# Altium schematic sheet Sheet1.SchDoc
size A; SheetNumber: 1; SheetTotal: 1
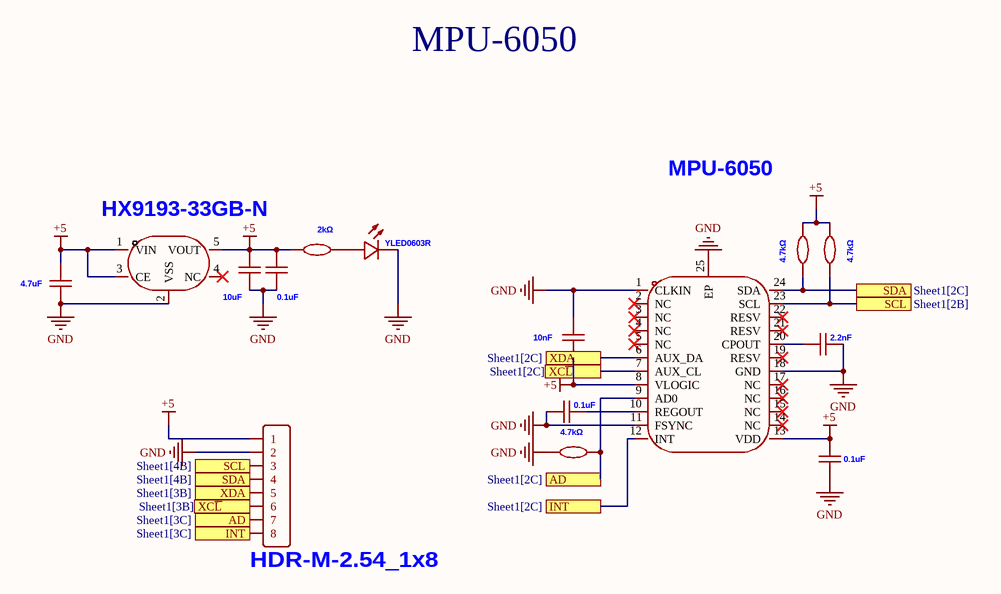
[diagram p0: Sheet1.SchDoc]

## Parts
(Parts that share a designator on the sheet are numbered #1, #2 ... from top to bottom, then left to right.)
BOOSTED_IN  HDR-M-2.54_1x8  [HDR-M-2.54_1X8]
C?#1  10uF  [C0402]
C?#2  0.1uF  [C0402]
C?#3  4.7uF  [C0402]
C?#4  10nF  [C0402]
C?#5  2.2nF  [C0402]
C?#6  0.1uF  [C0402]
C?#7  0.1uF  [C0402]
LED?  YLED0603R  [LED0603-FD]
R?#1  2kΩ  [R0603]
R?#2  4.7kΩ  [R0805]
R?#3  4.7kΩ  [R0805]
R?#4  4.7kΩ  [R0805]
U?#1  HX9193-33GB-N  [SOT-23-5_L2.9-W1.6-P0.95-LS2.8-BL]
U?#2  MPU-6050  [QFN-24_L4.0-W4.0-P0.50-BL-EP2.7]

## Ports
AD (see Sheet1[2C]), AD (see Sheet1[3C]), INT (see Sheet1[2C]), INT (see Sheet1[3C]), SCL (see Sheet1[2B]), SCL (see Sheet1[4B]), SDA (see Sheet1[2C]), SDA (see Sheet1[4B]), XC~{L} (see Sheet1[2C]), XC~{L} (see Sheet1[3B]), XDA (see Sheet1[2C]), XDA (see Sheet1[3B])

## Nets
+5: BOOSTED_IN.1 C?#1.2 C?#2.2 C?#3.2 C?#4.1 C?#7.2 R?#1.1 R?#2.2 R?#3.2 U?#1.1(VIN) U?#1.3(CE) U?#1.5(VOUT) U?#2.8(VLOGIC) U?#2.13(VDD)
GND: BOOSTED_IN.2 C?#1.1 C?#2.1 C?#3.1 C?#4.2 C?#5.2 C?#6.1 C?#7.1 LED?.2(-) R?#4.1 U?#1.2(VSS) U?#2.1(CLKIN) U?#2.11(FSYNC) U?#2.18(GND) U?#2.25(EP)
AD: BOOSTED_IN.7 R?#4.2 U?#2.9(AD0) ; port AD
INT: BOOSTED_IN.8 U?#2.12(INT) ; port INT
SCL: BOOSTED_IN.3 R?#3.1 U?#2.23(SCL) ; port SCL
SDA: BOOSTED_IN.4 R?#2.1 U?#2.24(SDA) ; port SDA
XC~{L}: BOOSTED_IN.6 U?#2.7(AUX_CL) ; port XC~{L}
XDA: BOOSTED_IN.5 U?#2.6(AUX_DA) ; port XDA
NetC?#5_1: C?#5.1 U?#2.20(CPOUT)
NetC?#6_2: C?#6.2 U?#2.10(REGOUT)
NetLED?_1: LED?.1(+) R?#1.2

Not connected (* = marked no-connect by the designer): U?#1 4(NC)*; U?#2 2(NC)* 3(NC)* 4(NC)* 5(NC)* 14(NC)* 15(NC)* 16(NC)* 17(NC)* 19(RESV)* 21(RESV)* 22(RESV)*

## Notes on the sheet
- MPU-6050

## Library data of the parts
C?#1-C?#7 = CL05A105KO5NNNC: Manufacturer: SAMSUNG(三星); Add into BOM: yes; Value: 1uF; Tolerance: ±10%; Symbol: CL05A105KO5NNNC; Device: CL05A105KO5NNNC; LCSC Part Name: 1uF ±10% 16V; Supplier Part: C29266; Manufacturer Part: CL05A105KO5NNNC; Supplier Footprint: 0402; JLCPCB Part Class: Extended Part; Datasheet: https://atta.szlcsc.com/upload/public/pdf/source/20160218/1457707763339.pdf; Supplier: LCSC; Convert to PCB: yes
LED? = YLED0603R: Manufacturer: YONGYUTAI(永裕泰); Add into BOM: yes; Emitted Color: Red; Forward Voltage (VF): 1.8V~2.4V; Forward Current: 25mA; Dominant Wavelength: 620nm~625nm; Symbol: YLED0603R; Device: YLED0603R; LCSC Part Name: YLED0603R; Supplier Part: C19171390; Manufacturer Part: YLED0603R; Supplier Footprint: 0603; JLCPCB Part Class: Extended Part; Datasheet: https://atta.szlcsc.com/upload/public/pdf/source/20231027/FB19AF06E2C70028E58AB5CEDD1BDC72.pdf; Supplier: LCSC; Convert to PCB: yes; Power Dissipation: -; Peak Wavelength: -; Diode Configuration: -; Lens Color: -; Color Temperature: -; Luminous Intensity: -; Viewing Angle: -; Mounting Sytle: -; Operating Temperature: -40℃~+85℃
R?#1 = 0603WAF2001T5E: Manufacturer: UNI-ROYAL(厚声); Add into BOM: yes; Tolerance: ±1%; Temperature Coefficient: ±100ppm/℃; Symbol: 0603WAF2001T5E; Device: 0603WAF2001T5E; LCSC Part Name: 2kΩ ±1% 100mW 厚膜电阻; Supplier Part: C22975; Manufacturer Part: 0603WAF2001T5E; Supplier Footprint: 0603; JLCPCB Part Class: Basic Part; Datasheet: https://atta.szlcsc.com/upload/public/pdf/source/20200306/C422600_1E6D84923E4A46A82E41ADD87F860B5C.pdf; Supplier: LCSC; Convert to PCB: yes; Type: Thick Film Resistors; Value: 2kΩ; Operating Temperature Range: -55℃~+155℃
R?#2-R?#4 = 0805W8F4701T5E: Manufacturer: UNI-ROYAL(厚声); Add into BOM: yes; Tolerance: ±1%; Temperature Coefficient: ±100ppm/℃; Symbol: 0805W8F4701T5E; Device: 0805W8F4701T5E; LCSC Part Name: 4.7kΩ ±1% 125mW 厚膜电阻; Supplier Part: C17673; Manufacturer Part: 0805W8F4701T5E; Supplier Footprint: 0805; JLCPCB Part Class: Basic Part; Datasheet: https://atta.szlcsc.com/upload/public/pdf/source/20200306/C422600_1E6D84923E4A46A82E41ADD87F860B5C.pdf; Supplier: LCSC; Convert to PCB: yes; Type: Thick Film Resistors; Value: 4.7kΩ; Operating Temperature Range: -55℃~+155℃
U?#1 = HX9193-33GB-N: Manufacturer: HX(恒佳兴); Add into BOM: yes; Output Voltage: 3.3V; Output Current: 300mA; Symbol: HX9193-33GB-N; Device: HX9193-33GB-N; LCSC Part Name: HX9193-33GB-N; Supplier Part: C2995655; Manufacturer Part: HX9193-33GB-N; Supplier Footprint: SOT-23-5; JLCPCB Part Class: Extended Part; Datasheet: https://atta.szlcsc.com/upload/public/pdf/source/20220412/18D9B33FD58646224E88440BBF52FED7.pdf; Supplier: LCSC; Convert to PCB: yes; Output Type: -; Voltage - Supply: -; Power Supply Rejection Ratio (PSRR): -; Voltage Dropout: -; standby current: -; Noise: -; Features: Low ESR；Overcurrent Protection(OCP)；With ability; Operating Temperature: -; Output Configuration: -; Number of Outputs: -
U?#2 = MPU-6050: Manufacturer: TDK InvenSense(应美盛); Symbol: MPU-6050_C24112; Add into BOM: yes; Sensor Type: 加速度计陀螺仪; Device: MPU-6050; LCSC Part Name: MPU-6050; Supplier Part: C24112; Manufacturer Part: MPU-6050; Supplier Footprint: QFN-24-EP(4x4); JLCPCB Part Class: Extended Part; Datasheet: https://atta.szlcsc.com/upload/public/pdf/source/20140425/1457707046159.pdf; Supplier: LCSC; Convert to PCB: yes; Operating Temperature: -40℃~+85℃